# EAGLE design Schematic (EAGLE 7.7.0)
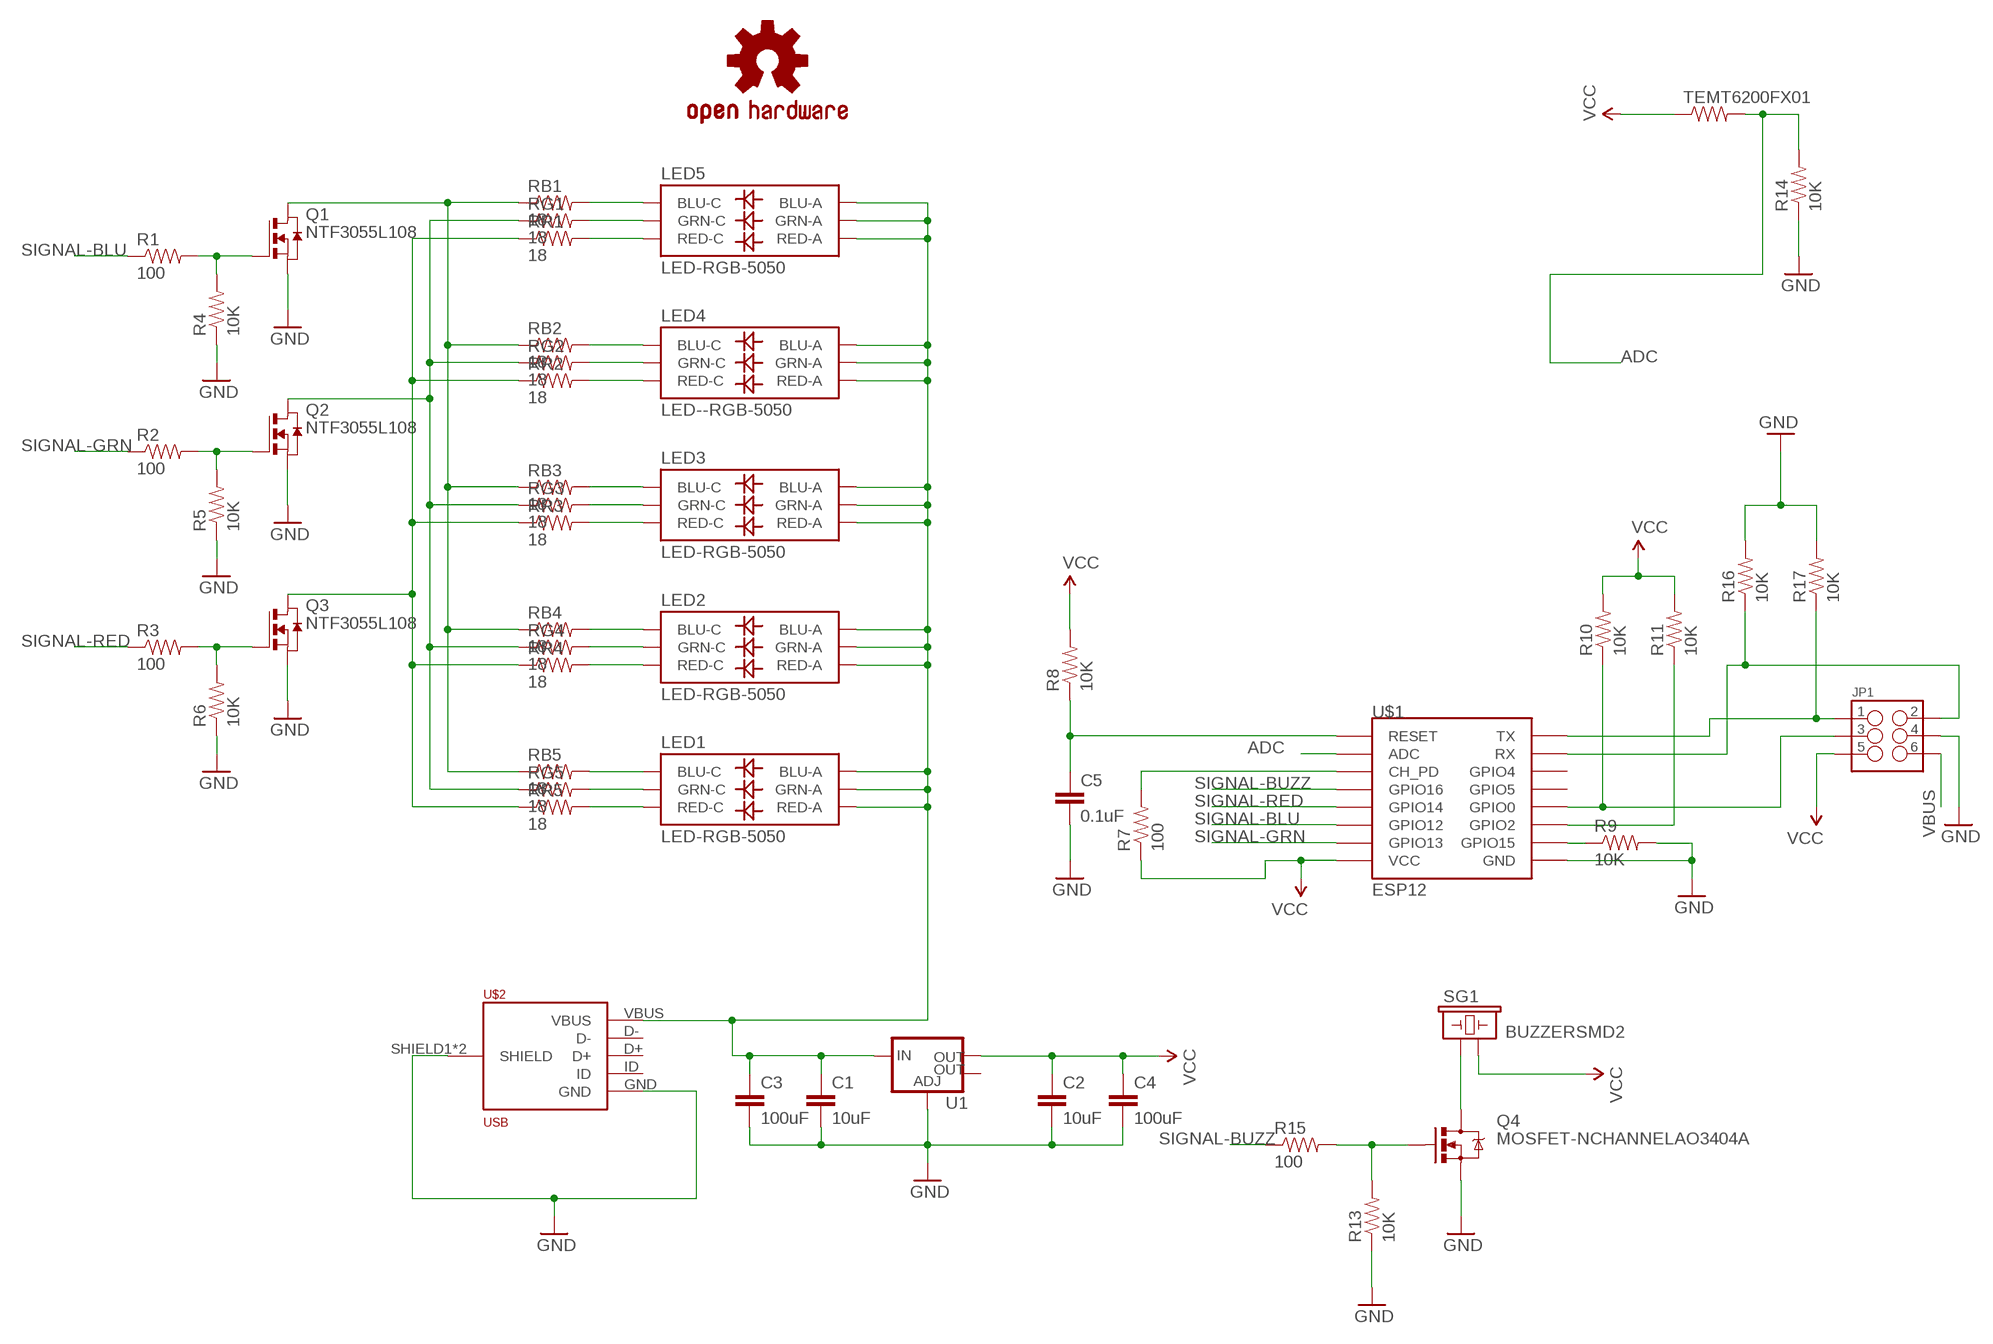
[diagram p0: schematic, sheet 1]

## Parts
C1  10uF  CAP0603-CAP  [0603-CAP]
C2  10uF  CAP0603-CAP  [0603-CAP]
C3  100uF  CAP1206  [1206]
C4  100uF  CAP1206  [1206]
C5  0.1uF  CAP0603-CAP  [0603-CAP]
JP1  M03X2POGO_PINS  [2X3_POGO]
LED1  LED-RGB-5050  LED-TRICOLOR-5050NO_IC  [LED-TRICOLOR-5050]
LED2  LED-RGB-5050  LED-TRICOLOR-5050NO_IC  [LED-TRICOLOR-5050]
LED3  LED-RGB-5050  LED-TRICOLOR-5050NO_IC  [LED-TRICOLOR-5050]
LED4  LED--RGB-5050  LED-TRICOLOR-5050NO_IC  [LED-TRICOLOR-5050]
LED5  LED-RGB-5050  LED-TRICOLOR-5050NO_IC  [LED-TRICOLOR-5050]
LOGO1  OSHW-LOGOM-COPPER  [OSHW-LOGO-M_COPPER]
Q1  NTF3055L108  NMOSSOT223'HEATSINK'  [SOT223HEAT]
Q2  NTF3055L108  NMOSSOT223'HEATSINK'  [SOT223HEAT]
Q3  NTF3055L108  NMOSSOT223'HEATSINK'  [SOT223HEAT]
Q4  MOSFET-NCHANNELAO3404A  [SOT23-3]
R1  100  RESISTOR0805-RES  [0805]
R2  100  RESISTOR0805-RES  [0805]
R3  100  RESISTOR0805-RES  [0805]
R4  10K  RESISTOR0805-RES  [0805]
R5  10K  RESISTOR0805-RES  [0805]
R6  10K  RESISTOR0805-RES  [0805]
R7  100  RESISTOR0805-RES  [0805]
R8  10K  RESISTOR0805-RES  [0805]
R9  10K  RESISTOR0805-RES  [0805]
R10  10K  RESISTOR0805-RES  [0805]
R11  10K  RESISTOR0805-RES  [0805]
R13  10K  RESISTOR0805-RES  [0805]
R14  10K  RESISTOR0805-RES  [0805]
R15  100  RESISTOR0805-RES  [0805]
R16  10K  RESISTOR0805-RES  [0805]
R17  10K  RESISTOR0805-RES  [0805]
RB1  18  RESISTOR1206  [1206]
RB2  18  RESISTOR1206  [1206]
RB3  18  RESISTOR1206  [1206]
RB4  18  RESISTOR1206  [1206]
RB5  18  RESISTOR1206  [1206]
RG1  18  RESISTOR1206  [1206]
RG2  18  RESISTOR1206  [1206]
RG3  18  RESISTOR1206  [1206]
RG4  18  RESISTOR1206  [1206]
RG5  18  RESISTOR1206  [1206]
RR1  18  RESISTOR1206  [1206]
RR2  18  RESISTOR1206  [1206]
RR3  18  RESISTOR1206  [1206]
RR4  18  RESISTOR1206  [1206]
RR5  18  RESISTOR1206  [1206]
SG1  BUZZERSMD2  [BUZZER-CCV]
TEMT6200FX01  RESISTOR0805-RES  [0805]
U1  V_REG_LM1117SOT223  [SOT223]
U$1  ESP12  [ESP12]
U$2  USB  [MICRO-USB3065-30-00-A]

## Nets
ADC: R14.2 TEMT6200FX01.2 U$1.ADC
GND [power]: C1.2 C2.2 C3.2 C4.2 C5.2 JP1.P$4 Q1.3(S) Q2.3(S) Q3.3(S) Q4.2(S) R4.1 R5.1 R6.1 R9.2 R13.1 R14.1 R16.2 R17.2 U1.1(ADJ) U$1.GND U$2.GND U$2.SHIELD1(SHIELD) U$2.SHIELD2(SHIELD)
N$1 [power]: LED5.4(BLU-C) RB1.2
N$3 [power]: LED1.4(BLU-C) RB5.2
N$4 [power]: LED5.6(GRN-C) RG1.2
N$5 [power]: Q1.2(D) Q1.4(D) Q1.P$1(D) Q1.P$2(D) Q1.P$3(D) Q1.P$4(D) Q1.P$5(D) Q1.P$6(D) Q1.P$7(D) Q1.P$8(D) Q1.P$9(D) Q1.P$10(D) Q1.P$11(D) Q1.P$12(D) Q1.P$13(D) Q1.P$14(D) Q1.P$15(D) Q1.P$16(D) Q1.P$17(D) Q1.P$18(D) Q1.P$19(D) RB1.1 RB2.1 RB3.1 RB4.1 RB5.1
N$6 [power]: LED5.5(RED-C) RR1.2
N$7 [power]: Q2.2(D) Q2.4(D) Q2.P$1(D) Q2.P$2(D) Q2.P$3(D) Q2.P$4(D) Q2.P$5(D) Q2.P$6(D) Q2.P$7(D) Q2.P$8(D) Q2.P$9(D) Q2.P$10(D) Q2.P$11(D) Q2.P$12(D) Q2.P$13(D) Q2.P$14(D) Q2.P$15(D) Q2.P$16(D) Q2.P$17(D) Q2.P$18(D) Q2.P$19(D) RG1.1 RG2.1 RG3.1 RG4.1 RG5.1
N$8 [power]: LED4.4(BLU-C) RB2.2
N$9 [power]: Q3.2(D) Q3.4(D) Q3.P$1(D) Q3.P$2(D) Q3.P$3(D) Q3.P$4(D) Q3.P$5(D) Q3.P$6(D) Q3.P$7(D) Q3.P$8(D) Q3.P$9(D) Q3.P$10(D) Q3.P$11(D) Q3.P$12(D) Q3.P$13(D) Q3.P$14(D) Q3.P$15(D) Q3.P$16(D) Q3.P$17(D) Q3.P$18(D) Q3.P$19(D) RR1.1 RR2.1 RR3.1 RR4.1 RR5.1
N$10 [power]: LED4.6(GRN-C) RG2.2
N$11 [power]: LED4.5(RED-C) RR2.2
N$12 [power]: LED3.4(BLU-C) RB3.2
N$13 [power]: LED3.6(GRN-C) RG3.2
N$14 [power]: LED3.5(RED-C) RR3.2
N$15 [power]: LED2.4(BLU-C) RB4.2
N$16 [power]: LED2.6(GRN-C) RG4.2
N$17 [power]: LED2.5(RED-C) RR4.2
N$18 [power]: LED1.6(GRN-C) RG5.2
N$19 [power]: LED1.5(RED-C) RR5.2
N$20: Q1.1(G) R1.2 R4.2
N$21: Q2.1(G) R2.2 R5.2
N$22: Q3.1(G) R3.2 R6.2
N$45 [power]: R7.2 U$1.CH_PD
N$46 [power]: JP1.P$3 R10.1 U$1.GPIO0
N$47 [power]: C5.1 R8.1 U$1.RESET
N$48 [power]: R11.1 U$1.GPIO2
N$49 [power]: R9.1 U$1.GPIO15
N$52: JP1.P$1 R17.1 U$1.TX
N$53: JP1.P$2 R16.1 U$1.RX
N$82: Q4.1(G) R13.2 R15.2
N$83 [power]: Q4.3(D) SG1.+
SIGNAL-BLU: R1.1 U$1.GPIO12
SIGNAL-BUZZ: R15.1 U$1.GPIO16
SIGNAL-GRN: R2.1 U$1.GPIO13
SIGNAL-RED: R3.1 U$1.GPIO14
VBUS [power]: C1.1 C3.1 JP1.P$6 LED1.1(GRN-A) LED1.2(RED-A) LED1.3(BLU-A) LED2.1(GRN-A) LED2.2(RED-A) LED2.3(BLU-A) LED3.1(GRN-A) LED3.2(RED-A) LED3.3(BLU-A) LED4.1(GRN-A) LED4.2(RED-A) LED4.3(BLU-A) LED5.1(GRN-A) LED5.2(RED-A) LED5.3(BLU-A) U1.3(IN) U$2.VBUS
VCC [power]: C2.1 C4.1 JP1.P$5 R7.1 R8.2 R10.2 R11.2 SG1.- TEMT6200FX01.1 U1.2(OUT) U$1.VCC
Unconnected: U1.4(OUT) U$1.GPIO4 U$1.GPIO5 U$2.D+ U$2.D- U$2.ID

## Library data of the parts
C1-C5 = SparkFun-Capacitors:CAP: Capacitor Standard 0603 ceramic capacitor, and 0.1" leaded capacitor.
JP1 = SparkFun-Connectors:M03X2: 2x3 .1" header. Shrouded, with keying- CONN-10681 SMT- CONN-11415 Pogo pins- HW-11044; PROD_ID: HW-11044
LED1-LED5 = SparkFun-LED:LED-TRICOLOR-5050
LOGO1 = SparkFun-Aesthetics:OSHW-LOGO: Open Source Hardware Logo This logo indicates the piece of hardware it is found on incorporates a OSHW license and/or adheres to the definition of open source hardware found here: http://freedomdefined.org/OSHW
Q1-Q3 = MCustom:NMOSSOT223: MOS FET
Q4 = SparkFun-DiscreteSemi:MOSFET-NCHANNEL: Common NMOSFET Parts MFG P/N Store ID Prod ID FDD8780 TRANS-09984 SI7820DN TRANS-11055 FDS6630A IC-08089 2N7002PW TRANS-11151 FQP30N06L COM-10213 TRANS-10060 BSS123LT1G TRANS-08345 BSS138 TRANS-00830 BS170 2N7000; PROD_ID: TRAN-12988
R1-R11 R13-R17 RB1-RB5 RG1-RG5 RR1-RR5 TEMT6200FX01 = SparkFun-Passives:RESISTOR: Resistor Basic schematic elements and footprints for 0603, 1206, and PTH resistors.
SG1 = SparkFun-Electromechanical:BUZZER: Buzzer 12mm Spark Fun Electronics SKU : Comp-Buzzer
U1 = SparkFun-PowerIC:V_REG_LM1117: Voltage Regulator LM1117 Standard adjustable voltage regulator but in SMD form. Spark Fun Electronics SKU : COM-00595; PROD_ID: VREG-08170
U$1 = esp8266modules:ESP12: ESP8266 Wifi module 12
U$2 = MCustom:USB

## Net classes
0 default: clearance 0.205 mm
1 power: width 0.406 mm

## Board
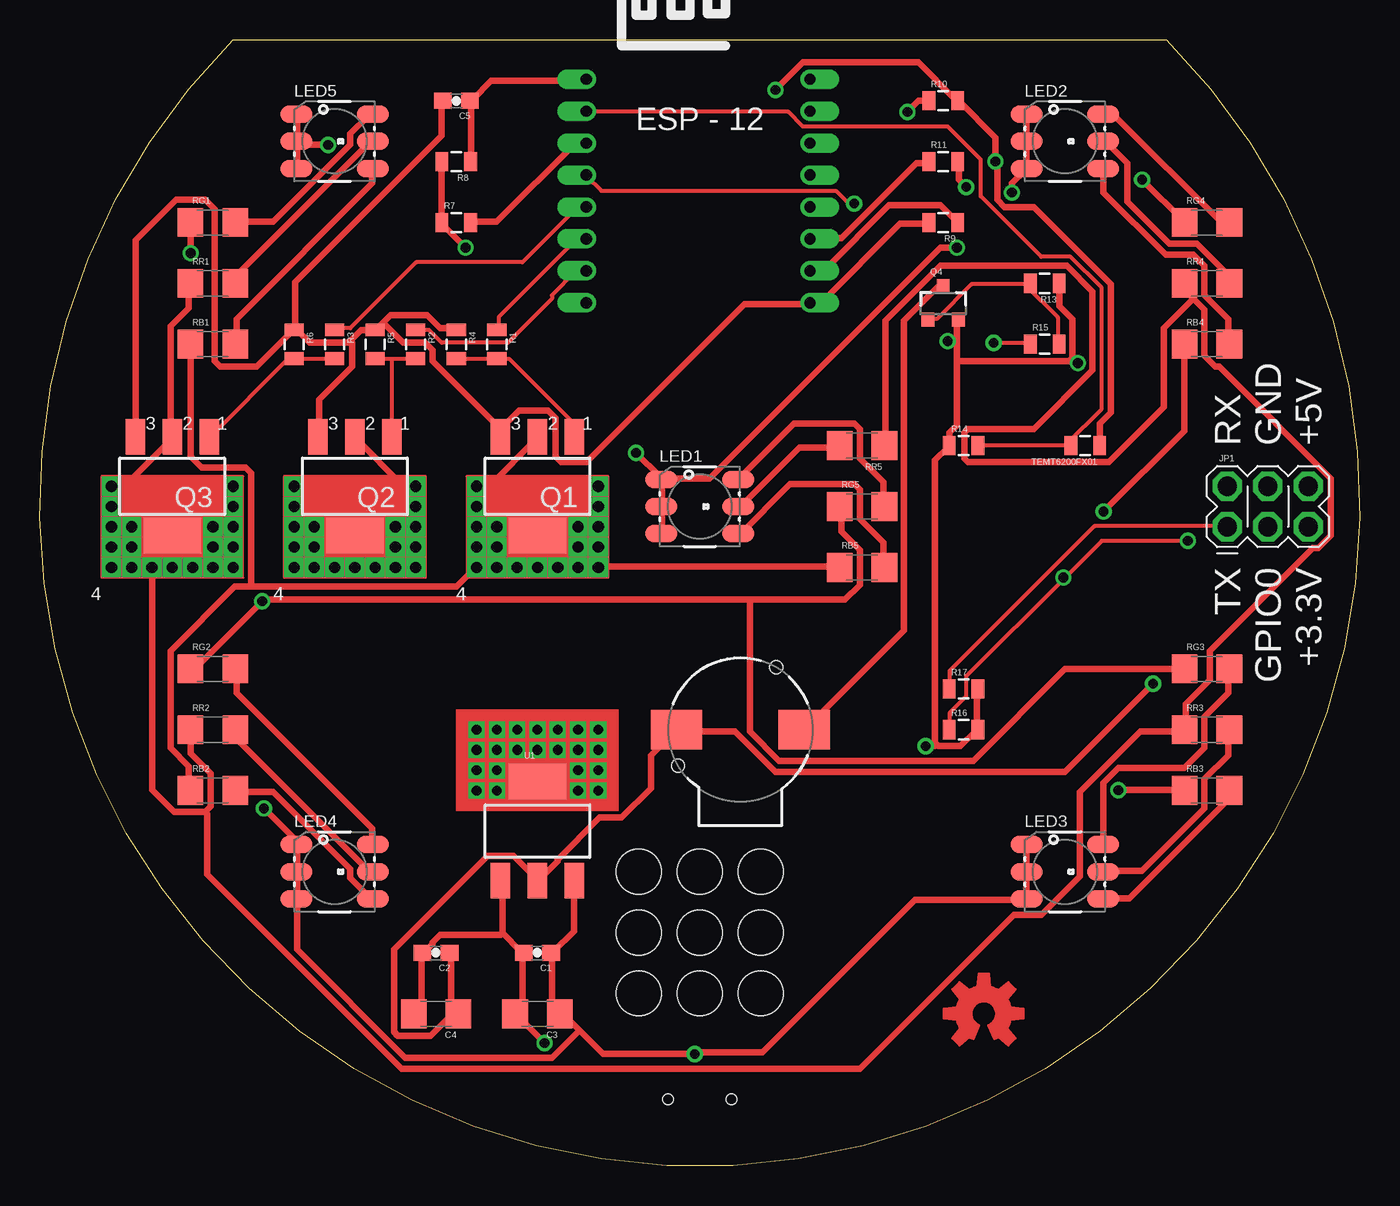
[diagram p1: board, top side]
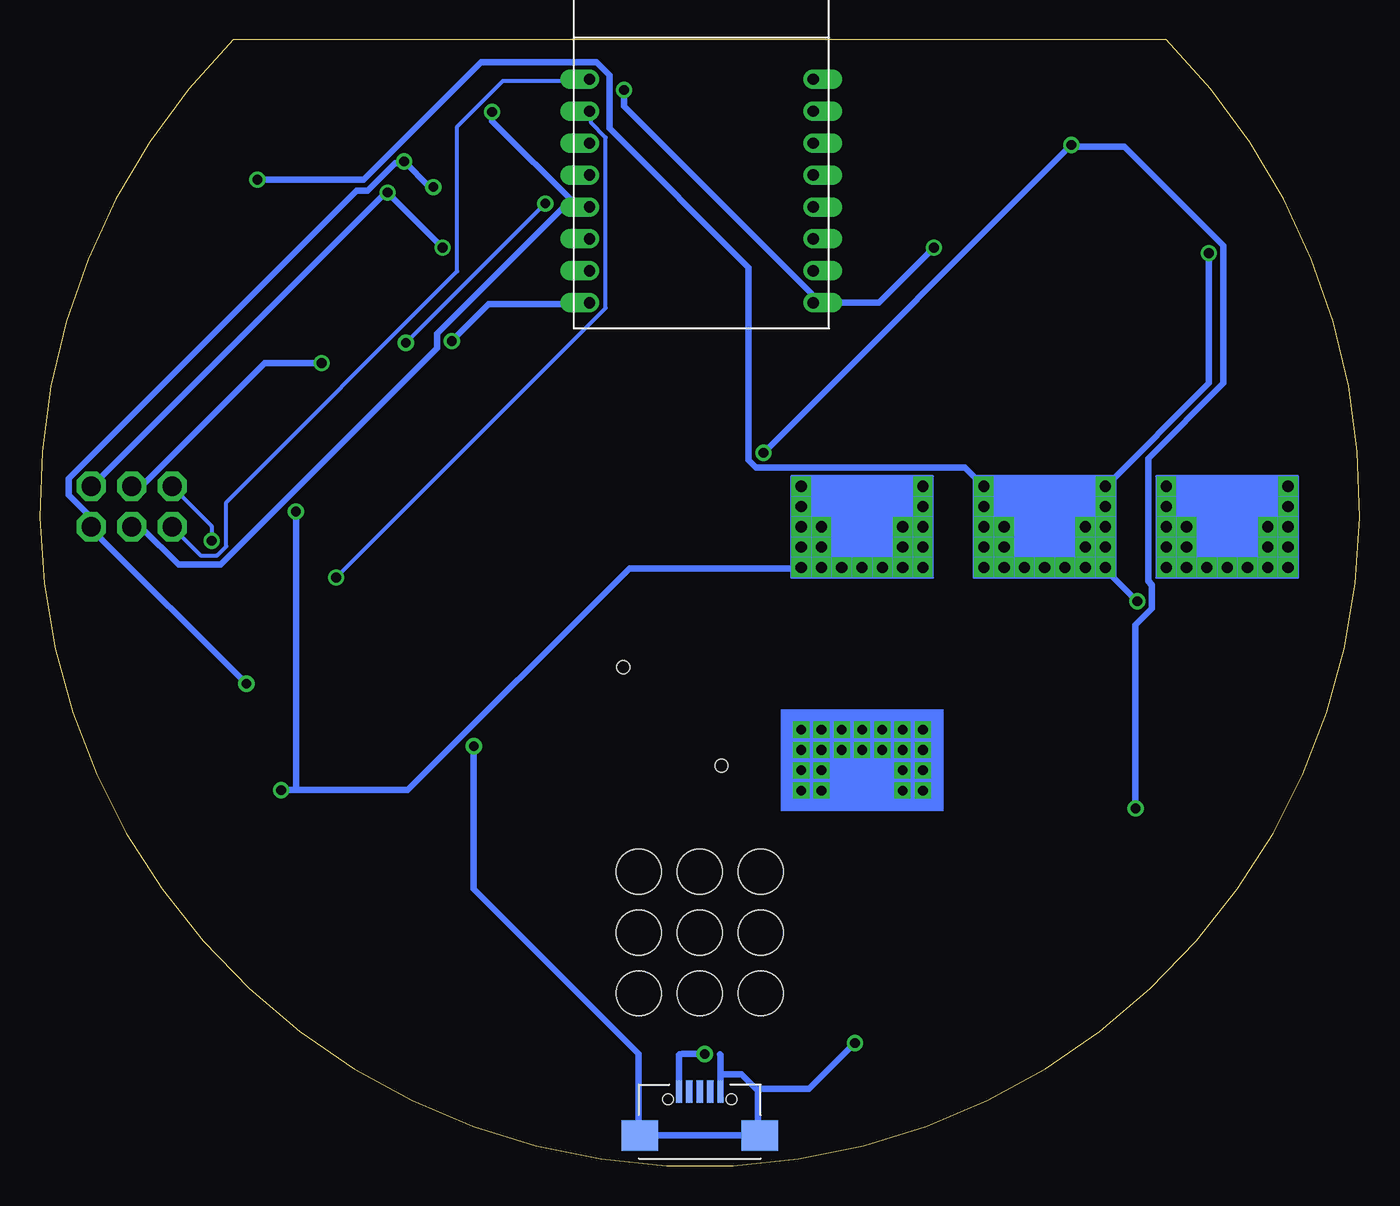
[diagram p2: board, bottom side, seen from below]

Size 82.61 x 70.47 mm. Coordinates in mm from the lower left corner, seen from the top.
Outline: 70.51,70.47 arc-270 12.09,70.47 70.51,70.47
Copper layers (1*16): Top 0.035mm / dielectric 1.5mm / Bottom 0.035mm
Design rules "default *": minimum track width 10mil, minimum drill 24mil, track to track 8mil, track to pad 8mil, pad to pad 8mil, via to via 8mil, smd to smd 8mil, copper to edge 40mil, drill to drill 8mil, minimum pad ring 10mil, minimum via ring 8mil, stop-mask expansion 4mil, vias tented up to drill 0mil, thermal gap 10mil
Holes 2.8 mm at 41.3,18.4 37.49,18.4 45.11,18.4 45.11,14.59 41.3,14.59 37.49,14.59 45.11,10.78 41.3,10.78 37.49,10.78

### Footprints (pad centres in the part's own frame; a part is rotated, then mirrored left to right if it is on the bottom)
0603-CAP = smd 1.1 x 1: 1 -0.85,0; 2 0.85,0
1206 = smd 1.6 x 1.8: 1 -1.4,0; 2 1.4,0
2X3_POGO = drill 1.2 pad 1.829 octagon: P$1 0,0; P$2 0,2.54; P$3 2.54,0; P$4 2.54,2.54; P$5 5.08,0; P$6 5.08,2.54
LED-TRICOLOR-5050 = smd 2 x 1.1: 1 -2.4,1.7; 2 -2.4,0; 3 -2.4,-1.7; 4 2.4,-1.7; 5 2.4,0; 6 2.4,1.7
SOT223HEAT = smd 1.219 x 2.235: 1 -2.311,-3.099; 2 0,-3.099; 3 2.311,-3.099 | smd 3.6 x 2.2: 4 0,3.099 | drill 0.7 square: P$1 -2.54,2.54; P$2 -2.54,3.81; P$3 -2.54,5.08; P$4 -1.27,5.08; P$5 0,5.08; P$6 1.27,5.08; P$7 2.54,5.08; P$8 2.54,3.81; P$9 2.54,2.54; P$10 -3.81,2.54; P$11 -3.81,3.81; P$12 -3.81,5.08; P$13 3.81,5.08; P$14 3.81,3.81; P$15 3.81,2.54; P$16 3.81,1.27; P$17 3.81,0; P$18 -3.81,0; P$19 -3.81,1.27
SOT23-3 = smd 0.8 x 0.9: 1 -0.95,-1; 2 0.95,-1; 3 0,1.1
0805 = smd 0.8 x 1.2: 1 -0.9,0; 2 0.9,0
BUZZER-CCV = smd 3.2 x 2.5: + 4,0; - -4,0 | hole 0.8: -3.9,-2.25; 2.25,3.9
SOT223 = smd 1.219 x 2.235: 1 -2.311,-3.099; 2 0,-3.099; 3 2.311,-3.099 | smd 3.6 x 2.2: 4 0,3.099
ESP12 = drill 0.7 offset: ADC -7.1,3.8; CH_PD -7.1,1.8; GND 6.9,-8.2; GPIO0 6.9,-2.2; GPIO2 6.9,-4.2; GPIO4 6.9,1.8; GPIO5 6.9,-0.2; GPIO12 -7.1,-4.2; GPIO13 -7.1,-6.2; GPIO14 -7.1,-2.2; GPIO15 6.9,-6.2; GPIO16 -7.1,-0.2; RESET -7.1,5.8; RX 6.9,3.8; TX 6.9,5.8; VCC -7.1,-8.2
MICRO-USB3065-30-00-A = smd 0.4 x 1.4: D+ 0,2.75; D- -0.65,2.75; GND 1.3,2.75; ID 0.65,2.75; VBUS -1.3,2.75 | smd 2.3 x 1.9: SHIELD1 -3.75,0; SHIELD2 3.75,0 | hole 0.65: -2,2.25; 2,2.25

### Placement (x,y rotation side)
C1  31.14,13.32 180 top
C2  24.79,13.32 180 top
C3  31.14,9.51 180 top
C4  24.79,9.51 180 top
C5  26.06,66.66 180 top
JP1  74.32,39.99 0 top
LED1  41.3,41.26 0 top
LED2  64.16,64.12 0 top
LED3  64.16,18.4 0 top
LED4  18.44,18.4 0 top
LED5  18.44,64.12 0 top
LOGO1  59.08,9.51 0 top
Q1  31.14,42.53 180 top
Q2  19.71,42.53 180 top
Q3  8.28,42.53 180 top
Q4  56.54,53.96 0 top
R1  28.6,51.42 270 top
R2  23.52,51.42 270 top
R3  18.44,51.42 270 top
R4  26.06,51.42 270 top
R5  20.98,51.42 270 top
R6  15.9,51.42 270 top
R7  26.06,59.04 0 top
R8  26.06,62.85 180 top
R9  56.54,59.04 180 top
R10  56.54,66.66 0 top
R11  56.54,62.85 0 top
R13  62.89,55.23 180 top
R14  57.81,45.07 0 top
R15  62.89,51.42 0 top
R16  57.81,27.29 0 top
R17  57.81,29.83 0 top
RB1  10.82,51.42 0 top
RB2  10.82,23.48 0 top
RB3  73.05,23.48 0 top
RB4  73.05,51.42 0 top
RB5  51.46,37.45 0 top
RG1  10.82,59.04 0 top
RG2  10.82,31.1 0 top
RG3  73.05,31.1 0 top
RG4  73.05,59.04 0 top
RG5  51.46,41.26 0 top
RR1  10.82,55.23 0 top
RR2  10.82,27.29 0 top
RR3  73.05,27.29 0 top
RR4  73.05,55.23 0 top
RR5  51.46,45.07 180 top
SG1  43.84,27.29 0 top
TEMT6200FX01  65.43,45.07 180 top
U1  31.14,20.94 0 top
U$1  41.3,62.21 0 top
U$2  41.3,1.89 0 bottom

### Tracks (layer width: path | path; a pad name or v marks a point on that pad's centre or on a via)
ADC
  Top 0.254: R14.2 58.78,45.08 64.52,45.08 TEMT6200FX01.2 64.29,45.19 66.47,47.37 66.47,54.95 64.52,56.9 62.68,56.9 58.89,60.68 58.89,62.98 56.83,65.05 47.76,65.05 46.85,65.96 34.22,65.96 U$1.ADC
GND  (via drill 0.61)
  Top 0.406: R9.2 55.57,58.96 53.85,58.96 48.91,54.03 48.22,54.03 U$1.GND 48.11,53.91 44.09,53.91 34.22,44.05 32.62,44.05 32.27,44.39 32.27,46.8 31.81,47.26 29.98,47.26 28.94,46.23 Q1.3 28.83,45.65 28.83,46.11 24.58,50.36 24.58,51.05 24.13,51.5 22.75,51.5 21.49,52.77 | C5.2 25.16,66.65 25.16,64.47 15.98,55.29 15.98,52.42 R6.1 | 19.42,51.62 19.31,51.5 16.9,51.5 16.09,52.31 R6.1 | 19.42,51.62 20.11,52.31 20.91,52.31 R5.1 21.14,52.42 21.49,52.77 | 21.49,52.77 21.95,53.23 24.24,53.23 25.04,52.42 25.96,52.42 R4.1 | Q3.3 5.99,45.65 5.99,57.93 8.52,60.46 10.36,60.46 10.93,59.88 10.93,50.36 11.27,50.01 13.57,50.01 15.75,52.19 R6.1 | Q2.3 17.47,45.65 17.47,47.95 19.54,50.01 19.54,51.5 19.42,51.62 | C4.2 23.44,9.62 23.9,10.08 23.9,13.29 C2.2 24.13,13.41 24.58,13.87 24.58,13.98 25.04,14.44 28.83,14.44 28.94,14.56 | 28.94,14.56 28.94,17.77 U1.1 | 28.94,14.56 30.09,13.41 C1.2 30.21,13.29 30.21,10.08 29.75,9.62 C3.2 29.86,9.39 v31.58,7.67 | R17.2 58.67,29.82 58.67,27.29 R16.2 58.55,27.18 57.63,26.26 56.26,26.26 56.14,26.37 | 57.4,50.36 57.4,46.34 56.94,45.88 56.94,45.08 R14.1 56.83,44.96 56.03,44.16 56.03,26.49 56.14,26.37 | 57.4,50.36 57.4,51.62 | 57.4,51.62 57.4,52.88 Q4.2 | 64.63,50.59 64.63,53 63.83,53.8 63.83,55.18 R13.1 | 64.63,50.59 64.4,50.36 57.4,50.36 | 64.63,50.59 v64.98,50.24 | v55.45,26.26 56.03,26.26 56.14,26.37 | 57.4,51.62 v56.83,51.62
  Bottom 0.406: U$2.GND 40,5.72 | 40,5.72 40,6.94 40.03,6.97 | 40,5.72 38.7,5.72 37.67,4.69 | 37.67,4.69 37.67,2.05 U$2.SHIELD2 U$2.SHIELD1 45.12,2.05 45.12,6.98 55.45,17.31 v55.45,26.26 | v31.58,7.67 34.45,4.8 37.55,4.8 37.67,4.69 | v64.98,50.24 68.53,50.24 76.22,42.55 76.8,42.55 JP1.P$4 | v56.83,51.62 54.53,53.91 48.22,53.91 U$1.GND
N$1
  Top 0.406: RB1.2 12.31,51.5 12.31,53 20.8,61.49 20.8,62.41 LED5.4
N$3
  Top 0.406: RB5.2 52.81,37.5 52.81,39 51.32,40.49 51.32,42.32 50.98,42.67 46.96,42.67 43.75,39.46 LED1.4
N$4
  Top 0.406: RG1.2 12.31,59.08 14.6,59.08 19.42,63.9 19.42,64.59 20.57,65.73 20.8,65.73 LED5.6
N$5  (via drill 0.61)
  Top 0.406: Q1.2 31.12,45.54 28.14,42.55 27.34,42.55 Q1.P$17 27.34,42.32 27.34,41.29 Q1.P$16 27.34,41.06 27.34,40.14 Q1.P$15 27.34,39.91 27.34,38.88 Q1.P$14 27.34,38.65 27.34,37.62 Q1.P$13 | 13.22,36.24 26.08,36.24 27.22,37.39 Q1.P$13 | 13.22,36.24 12.19,36.24 8.18,32.23 8.18,26.14 9.32,25 9.32,23.51 RB2.1 | 13.22,36.24 13.22,43.36 12.88,43.7 10.13,43.7 9.44,44.39 9.44,51.39 RB1.1 | Q1.P$7 28.6,37.5 27.45,37.5 Q1.P$13 | Q1.P$7 28.72,37.5 29.86,37.5 Q1.P$6 29.98,37.5 31.12,37.5 Q1.P$5 | Q1.P$5 31.24,37.5 32.39,37.5 Q1.P$4 32.5,37.5 33.53,37.5 Q1.P$3 | Q1.P$7 28.6,37.62 28.6,38.65 Q1.P$8 28.6,38.88 28.6,39.91 Q1.P$9 | Q1.4 31.12,39.34 31.12,37.62 Q1.P$5 | v67.5,23.51 71.63,23.51 RB3.1 | RB5.1 50.06,37.5 35.03,37.5 Q1.P$12 34.8,37.5 33.76,37.5 Q1.P$3 | v66.58,40.95 71.63,46 71.63,51.39 RB4.1 | Q1.P$3 33.76,37.62 33.76,38.65 Q1.P$2 33.88,38.77 34.91,38.77 Q1.P$11 35.03,38.88 35.03,39.91 Q1.P$10 | Q1.P$10 35.03,40.14 35.03,41.18 Q1.P$19 35.03,41.41 35.03,42.44 Q1.P$18 | Q1.P$1 33.76,40.03 34.8,40.03 Q1.P$10
  Bottom 0.406: 66.58,23.51 59.58,23.51 45.7,37.39 35.03,37.39 Q1.P$12 | 66.58,23.51 v67.5,23.51 | 66.58,23.51 v66.58,40.95
N$6
  Top 0.406: RR1.2 12.31,55.29 12.31,55.75 20.57,64.01 20.8,64.01 LED5.5
N$7  (via drill 0.61)
  Top 0.406: v68.99,61.72 71.63,59.08 RG4.1 | Q2.2 19.76,45.54 22.75,42.55 23.44,42.55 Q2.P$18 23.55,42.32 23.55,41.29 Q2.P$19 | v9.44,57.13 9.44,58.96 RG1.1 | RG2.1 9.44,31.19 9.78,31.19 v13.91,35.32 14.03,35.44 44.44,35.44 | 44.44,35.44 50.4,35.44 51.32,36.36 51.32,38.54 50.17,39.69 50.17,41.18 RG5.1 | 44.44,35.44 44.44,27.18 46.27,25.34 58.44,25.34 64.17,31.08 71.63,31.08 RG3.1 | Q2.4 19.76,39.34 19.76,37.5 Q2.P$5
  Bottom 0.406: v68.99,61.72 62.34,61.72 54.99,69.06 47.76,69.06 46.96,68.26 46.96,64.93 38.24,56.21 38.24,44.16 37.78,43.7 24.7,43.7 23.55,42.55 Q2.P$18 | v9.44,57.13 9.44,48.98 15.86,42.55 Q2.P$17 15.86,42.32 15.86,41.29 Q2.P$16 15.98,41.06 15.98,40.14 Q2.P$15 | v13.91,35.32 15.98,37.39 Q2.P$13 | Q2.P$14 15.98,38.65 15.98,37.62 Q2.P$13 | Q2.P$15 15.98,39.91 15.98,38.88 Q2.P$14 | Q2.P$13 16.09,37.5 17.13,37.5 Q2.P$7 17.36,37.5 18.39,37.5 Q2.P$6 18.62,37.5 19.65,37.5 Q2.P$5 19.88,37.5 20.91,37.5 Q2.P$4 21.14,37.5 22.17,37.5 Q2.P$3 | Q2.P$8 17.13,38.77 16.09,38.77 Q2.P$14 | Q2.P$9 17.13,40.03 16.09,40.03 Q2.P$15 | Q2.P$12 23.44,37.5 22.4,37.5 Q2.P$3 | Q2.P$3 22.29,37.62 22.29,38.65 Q2.P$2 22.4,38.77 23.44,38.77 Q2.P$11 23.55,38.88 23.55,39.91 Q2.P$10 | Q2.P$1 22.29,40.03 23.32,40.03 Q2.P$10 | Q2.P$19 23.55,41.18 23.55,40.14 Q2.P$10
N$8
  Top 0.406: RB2.2 12.31,23.39 14.6,23.39 19.42,18.57 19.42,18 20.8,16.62 LED4.4
N$9
  Top 0.406: RR1.1 9.32,55.18 9.32,53.68 8.18,52.54 8.18,45.65 Q3.2 8.06,45.54 8.06,45.31 5.42,42.67 4.62,42.67 Q3.P$17 4.5,42.44 4.5,41.41 Q3.P$16 4.5,41.18 4.5,40.14 Q3.P$15 | Q3.P$14 4.5,38.65 4.5,37.5 Q3.P$13 4.62,37.5 5.65,37.5 Q3.P$7 5.88,37.5 6.91,37.5 Q3.P$6 | Q3.P$8 5.65,38.77 4.62,38.77 Q3.P$14 | Q3.P$15 4.5,39.91 4.5,38.88 Q3.P$14 | Q3.P$9 5.65,40.03 4.62,40.03 Q3.P$15 | 10.36,22.13 10.7,22.47 10.7,24.54 9.44,25.8 9.44,27.18 RR2.1 | 10.36,22.13 8.4,22.13 7.03,23.51 7.03,37.39 Q3.P$6 | Q3.P$5 8.18,37.5 7.14,37.5 Q3.P$6 | Q3.P$5 8.4,37.5 9.55,37.5 Q3.P$4 9.67,37.5 10.81,37.5 Q3.P$3 | Q3.P$3 10.93,37.5 12.08,37.5 Q3.P$12 12.08,37.62 12.08,38.65 Q3.P$11 12.08,38.88 12.08,39.91 Q3.P$10 | Q3.P$2 10.81,38.65 10.81,37.62 Q3.P$3 | Q3.P$10 12.08,40.14 12.08,41.18 Q3.P$19 12.08,41.41 12.08,42.44 Q3.P$18 | Q3.P$1 10.93,40.03 11.96,40.03 Q3.P$10 | Q3.4 8.29,39.34 8.29,37.62 Q3.P$5 | 72.21,54.26 71.75,54.72 71.75,55.18 RR4.1 | 72.21,54.26 72.89,53.57 72.89,50.7 73.58,50.01 73.81,50.01 80.81,43.01 80.81,39.46 80.01,38.65 79.66,38.65 73.24,32.23 73.24,30.39 71.75,28.9 71.75,27.29 RR3.1 71.52,27.18 68.88,27.18 65.09,23.39 65.09,18.11 62.68,15.7 60.96,15.7 51.32,6.06 22.63,6.06 10.47,18.23 10.47,22.01 10.36,22.13 | 72.21,54.26 70.37,52.42 70.37,47.49 66.93,44.05 58.09,44.05 57.86,44.28 57.86,45.88 58.09,46.11 62.22,46.11 65.89,49.78 65.89,54.72 64.29,56.32 56.37,56.32 52.93,52.88 52.93,45.08 RR5.1
N$10
  Top 0.406: RG2.2 12.31,31.08 12.31,29.59 20.8,21.1 20.8,20.18 LED4.6
N$11
  Top 0.406: RR2.2 12.31,27.18 12.31,26.72 20.57,18.46 20.8,18.46 LED4.5
N$12
  Top 0.406: RB3.2 74.39,23.39 74.39,22.93 68.19,16.74 66.58,16.74 LED3.4
N$13
  Top 0.406: RG3.2 74.39,31.08 74.39,29.59 72.89,28.1 72.89,26.14 71.63,24.88 67.5,24.88 66.58,23.96 66.58,20.18 LED3.6
N$14
  Top 0.406: RR3.2 74.39,27.18 74.39,25.69 72.89,24.19 72.89,22.36 68.99,18.46 66.58,18.46 LED3.5
N$15
  Top 0.406: RB4.2 74.39,51.5 74.39,53 72.89,54.49 72.89,56.32 72.21,57.01 70.48,57.01 66.58,60.91 66.58,62.41 LED2.4
N$16
  Top 0.406: RG4.2 74.39,59.08 73.93,59.08 67.27,65.73 66.58,65.73 LED2.6
N$17
  Top 0.406: RR4.2 74.39,55.29 74.39,55.75 72.43,57.7 70.71,57.7 68.07,60.34 68.07,62.75 66.81,64.01 66.58,64.01 LED2.5
N$18
  Top 0.406: RG5.2 52.81,41.29 52.81,42.78 51.32,44.28 51.32,46.11 50.98,46.46 47.19,46.46 43.75,43.01 LED1.6
N$19
  Top 0.406: RR5.2 50.06,44.96 47.53,44.96 43.75,41.18 LED1.5
N$20
  Top 0.254: R4.2 26.08,50.47 28.6,50.47 R1.2 28.72,50.47 29.4,50.47 33.42,46.46 33.42,45.65 Q1.1
N$21
  Top 0.254: 22.06,50.47 23.44,50.47 R2.2 | 22.06,50.47 21.03,50.47 R5.2 | 22.06,50.47 22.06,45.65 Q2.1
N$22
  Top 0.254: R3.2 18.39,50.47 15.98,50.47 R6.2 15.86,50.47 15.52,50.47 10.7,45.65 Q3.1
N$23  (via drill 0.6)
  other vias: 27.33,27.29
N$24  (via drill 0.6)
  other vias: 28.6,27.29
N$25  (via drill 0.6)
  other vias: 29.87,27.29
N$26  (via drill 0.6)
  other vias: 31.14,27.29
N$27  (via drill 0.6)
  other vias: 32.41,27.29
N$28  (via drill 0.6)
  other vias: 33.68,27.29
N$29  (via drill 0.6)
  other vias: 34.95,27.29
N$30  (via drill 0.6)
  other vias: 34.95,26.02
N$31  (via drill 0.6)
  other vias: 33.68,26.02
N$32  (via drill 0.6)
  other vias: 32.41,26.02
N$33  (via drill 0.6)
  other vias: 31.14,26.02
N$34  (via drill 0.6)
  other vias: 29.87,26.02
N$35  (via drill 0.6)
  other vias: 28.6,26.02
N$36  (via drill 0.6)
  other vias: 27.33,26.02
N$37  (via drill 0.6)
  other vias: 27.33,24.75
N$38  (via drill 0.6)
  other vias: 28.6,24.75
N$39  (via drill 0.6)
  other vias: 33.68,24.75
N$40  (via drill 0.6)
  other vias: 34.95,24.75
N$41  (via drill 0.6)
  other vias: 34.95,23.48
N$42  (via drill 0.6)
  other vias: 33.68,23.48
N$43  (via drill 0.6)
  other vias: 28.6,23.48
N$44  (via drill 0.6)
  other vias: 27.33,23.48
N$45
  Top 0.406: R7.2 26.99,59.08 28.6,59.08 33.53,64.01 34.11,64.01 U$1.CH_PD
N$46  (via drill 0.61)
  Top 0.406: v54.3,65.96 54.99,66.65 55.57,66.65 R10.1
  Bottom 0.406: v54.3,65.96 54.3,65.39 49.03,60.11 48.22,60.11 U$1.GPIO0 49.48,60.34 57.75,52.08 57.75,51.16 71.29,37.62 73.93,37.62 76.22,39.91 76.8,39.91 JP1.P$3
N$47
  Top 0.406: R8.1 26.99,62.86 26.99,66.65 C5.1 27.11,66.77 28.26,67.91 34.11,67.91 U$1.RESET
N$48
  Top 0.406: R11.1 55.57,62.75 54.88,62.75 50.17,58.05 48.22,58.05 U$1.GPIO2
N$49
  Top 0.406: R9.1 57.4,59.08 56.37,60.11 53.16,60.11 49.14,56.09 48.22,56.09 U$1.GPIO15
N$52
  Top 0.254: R17.1 56.94,29.93 56.94,30.96 66.01,40.03 74.27,40.03 JP1.P$1
  Bottom 0.254: U$1.TX 48.22,67.91 53.62,67.91 56.48,65.05 56.48,55.98 70.94,41.52 70.94,38.77 71.52,38.19 72.55,38.19 74.27,39.91 JP1.P$1
N$53  (via drill 0.61)
  Top 0.254: 64.12,36.76 66.47,39.11 v71.86,39.11 | 64.12,36.76 57.98,30.62 57.98,29.36 56.94,28.32 56.94,27.29 R16.1 | v64.06,36.82 64.12,36.76
  Bottom 0.254: v71.86,39.11 71.86,40.03 74.27,42.44 JP1.P$2 | v64.06,36.82 47.19,53.68 47.19,64.36 48.11,65.27 48.11,65.96 U$1.RX
N$82
  Top 0.254: Q4.1 55.68,53 56.14,53 58.32,55.18 61.99,55.18 R13.2 61.76,55.06 63.71,53.11 63.71,51.5 R15.2
N$83
  Top 0.406: Q4.3 56.48,54.95 56.14,54.95 54.08,52.88 54.08,33.49 47.88,27.29 SG1.+
SIGNAL-BLU
  Top 0.254: R1.1 28.72,52.42 28.72,53.11 33.53,57.93 34.11,57.93 U$1.GPIO12
SIGNAL-BUZZ  (via drill 0.61)
  Top 0.254: v59.7,51.5 61.99,51.5 R15.1 | v50.98,60.23 50.63,60.23 49.83,61.03 35.14,61.03 34.22,61.95 U$1.GPIO16
  Bottom 0.254: v50.98,60.23 v59.7,51.5
SIGNAL-GRN
  Top 0.254: R2.1 23.55,52.31 24.35,52.31 25.16,51.5 29.29,51.5 32.04,54.26 32.04,54.49 33.53,55.98 34.11,55.98 U$1.GPIO13
SIGNAL-RED
  Top 0.254: R3.1 18.5,52.42 19.42,52.42 23.55,56.55 30.21,56.55 33.65,60 34.11,60 U$1.GPIO14
VBUS  (via drill 0.61)
  Top 0.406: LED3.1 61.76,20.06 61.76,18.57 LED3.2 61.76,18.34 61.76,16.74 LED3.3 61.65,16.62 54.76,16.62 45.24,7.1 41.11,7.1 v40.99,6.98 35.26,6.98 33.76,8.47 | 33.76,8.47 32.73,9.51 C3.1 32.5,9.62 32.04,10.08 32.04,13.29 C1.1 32.16,13.41 33.42,14.67 33.42,17.77 U1.3 | 33.76,8.47 32.04,6.75 22.86,6.75 16.09,13.52 16.09,16.51 LED4.3 16.09,16.74 16.09,18.34 LED4.2 16.09,18.57 16.09,20.06 LED4.1 16.09,20.29 v14.03,22.36 | LED5.3 16.09,62.52 16.09,64.01 LED5.2 | LED5.1 16.09,65.73 16.09,64.24 LED5.2 | LED1.3 38.93,39.57 38.93,41.18 LED1.2 38.93,41.41 38.93,42.9 LED1.1 | LED2.1 61.76,65.73 61.76,64.24 LED2.2 61.76,64.01 61.76,62.52 LED2.3 61.65,62.29 60.85,61.49 v60.85,60.91 | v57.4,57.47 56.37,57.47 41.91,43.01 39.04,43.01 LED1.1 | v18.04,63.9 16.21,63.9 LED5.2 | v37.32,44.62 38.81,43.13 LED1.1
  Bottom 0.406: U$2.VBUS 42.6,6.94 42.57,6.97 42.37,6.98 v40.99,6.98 | v57.4,57.47 v60.85,60.91 60.96,60.91 79.32,42.55 JP1.P$6 | v37.32,44.62 v18.04,63.9 17.93,63.78 14.72,63.78 8.52,57.59 8.52,48.98 13.22,44.28 13.22,36.59 12.99,36.36 12.99,34.87 14.03,33.83 v14.03,22.36
VCC  (via drill 0.61)
  Top 0.406: C2.1 25.73,13.29 25.73,10.08 26.19,9.62 C4.1 25.96,9.62 24.47,8.13 22.4,8.13 22.17,8.36 22.17,13.52 28.03,19.37 29.63,19.37 31.01,18 U1.2 31.24,17.88 32.39,19.03 32.39,19.15 35.03,21.78 36.4,21.78 38.24,23.62 38.24,25.69 39.73,27.18 SG1.- 39.96,27.18 43.52,27.18 46.04,24.65 64.17,24.65 v69.68,30.16 | R8.2 25.16,62.75 25.16,59.08 R7.1 25.27,58.85 v26.65,57.47 | v57.98,61.26 57.52,61.72 57.52,62.75 R11.2 | TEMT6200FX01.1 66.35,45.08 66.35,46.46 67.04,47.14 67.04,55.18 62.22,60 60.39,60 59.93,60.46 59.93,62.75 v59.81,62.86 59.81,64.36 57.52,66.65 R10.2 57.29,66.77 54.99,69.06 47.76,69.06 v46.04,67.34
  Bottom 0.406: v26.65,57.47 30.09,54.03 34.11,54.03 U$1.VCC 34.34,54.14 34.34,54.6 46.04,66.31 v46.04,67.34 | v57.98,61.26 58.21,61.26 v59.81,62.86 59.93,62.75 60.39,62.75 62.11,61.03 62.8,61.03 80.81,43.01 80.81,41.98 79.43,40.6 79.43,40.03 JP1.P$5 79.32,39.8 v69.68,30.16
(copper drawn outside any net)
  shapes: Bottom area x1, Top area x1

### Text on the board
tNames: RX | GND | +5V | TX | GPIO0 | +3.3V